# EAGLE design Callisto_Teknic_MSO_PBx4_single (EAGLE 9.6.2)
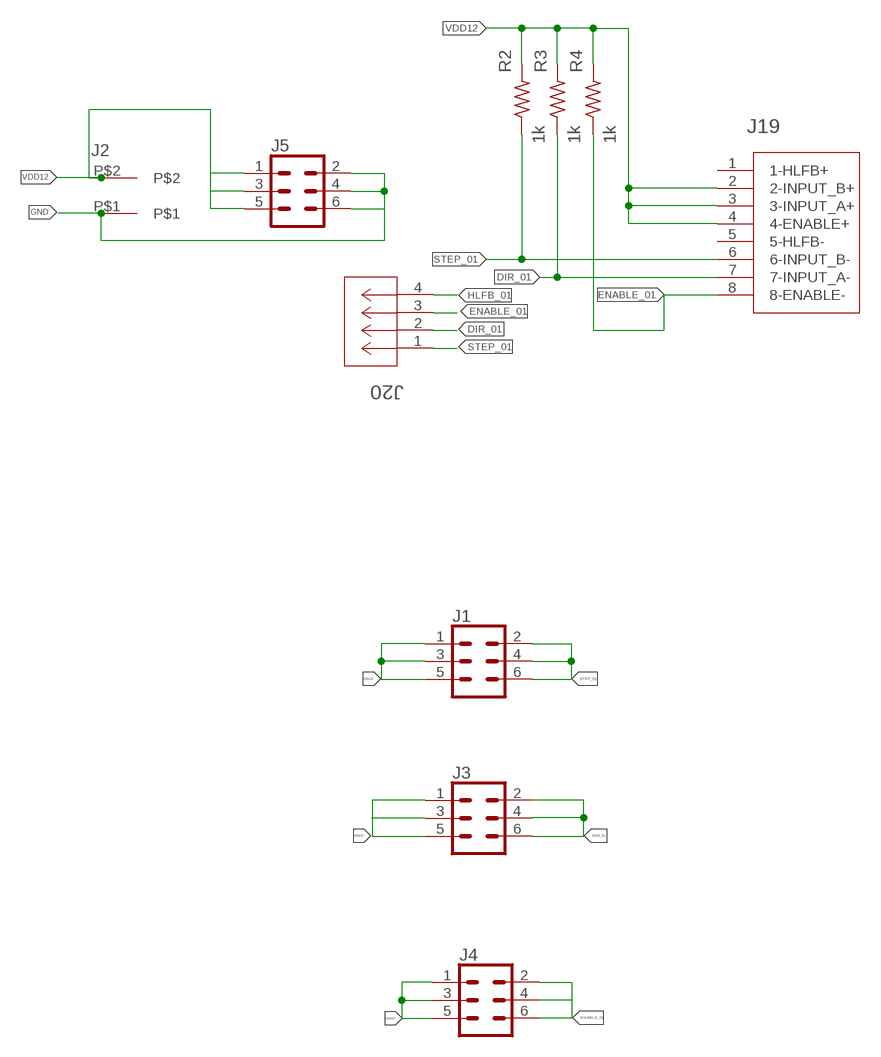
[diagram p0: schematic, sheet 1]

## Parts
J1  CONN_03X2  [2X3]
J2  2-pos  3.81MM_1_X_2_RT_ANGLE_PLUG_HEADER  [2_3.81MM_PITCH]
J3  CONN_03X2  [2X3]
J4  CONN_03X2  [2X3]
J5  CONN_03X2  [2X3]
J19  TEKNIC_8PIN_MOTOR  [CON_39281083]
J20  CONN_530470410_PICOBLADE_X_4  [CON_530470410_MOL]
R2  1k  R_0805  [0805]
R3  1k  R_0805  [0805]
R4  1k  R_0805  [0805]

## Nets
DIR_01: J3.2 J3.4 J3.6 J19.7(7-INPUT_A-) J20.2 R3.1
ENABLE_01: J4.2 J4.4 J4.6 J19.8(8-ENABLE-) J20.3 R4.1
GND: J1.1 J1.3 J1.5 J2.P$1 J3.1 J3.3 J3.5 J4.1 J4.3 J4.5 J5.2 J5.4 J5.6
HLFB_01: J20.4
STEP_01: J1.2 J1.4 J1.6 J19.6(6-INPUT_B-) J20.1 R2.1
VDD12: J2.P$2 J5.1 J5.3 J5.5 J19.2(2-INPUT_B+) J19.3(3-INPUT_A+) J19.4(4-ENABLE+) R2.2 R3.2 R4.2
Unconnected: J19.1(1-HLFB+) J19.5(5-HLFB-)

## Library data of the parts
J1 J3-J5 = 3D_MIG_Controller:CONN_03X2: Multi connection point. Often used as Generic Header-pin footprint for 0.1 inch spaced/style header connections For AVR SPI programming port, see special device with nice symbol: "AVR_SPI_PROG_5x2.dev" You can populate with any combo of single row headers, but if you'd like an exact match, check these: 2x5 AVR ICSP Male Header <https://www.sparkfun.com/products/778> (PRT-00778) 2x5 Pin Shrouded Header <https://www.sparkfun.com/products/8506> (PRT-08506) On any of the 0.1 inch spaced packages, you can populate with these: Break Away Headers - Straight <https://www.sparkfun.com/products/116> (PRT-00116) Break Away Male Headers - Right Angle <https://www.sparkfun.com/products/553> (PRT-00553) Female Headers <https://www.sparkfun.com/products/115> (PRT-00115) Break Away Headers - Machine Pin <https://www.sparkfun.com/products/117> (PRT-00117) Break Away Female Headers - Swiss Machine Pin <https://www.sparkfun.com/products/743> (PRT-00743) Special note: the shrouded connector mates well with our 5x2 ribbon cables: 2x5 Pin IDC Ribbon Cable <https://www.sparkfun.com/products/8535> (PRT-08535)
J2 = 3D_MIG_Controller:3.81MM_1_X_2_RT_ANGLE_PLUG_HEADER: TERM BLOCK HDR 2POS 90DEG 3.81MM; PARTNO: 691322310002
J19 = 3D_MIG_Controller:TEKNIC_8PIN_MOTOR; COPYRIGHT: Copyright (C) 2022 Ultra Librarian. All rights reserved.; MANUFACTURER_PART_NUMBER: 39281083; MFR_NAME: Molex Connector Corporation
J20 = 3D_MIG_Controller:CONN_530470410_PICOBLADE_X_4; COPYRIGHT: Copyright (C) 2022 Ultra Librarian. All rights reserved.; MANUFACTURER_PART_NUMBER: 530470410; MFR_NAME: Molex Connector Corporation
R2-R4 = 3D_MIG_Controller:R_0805

## Board
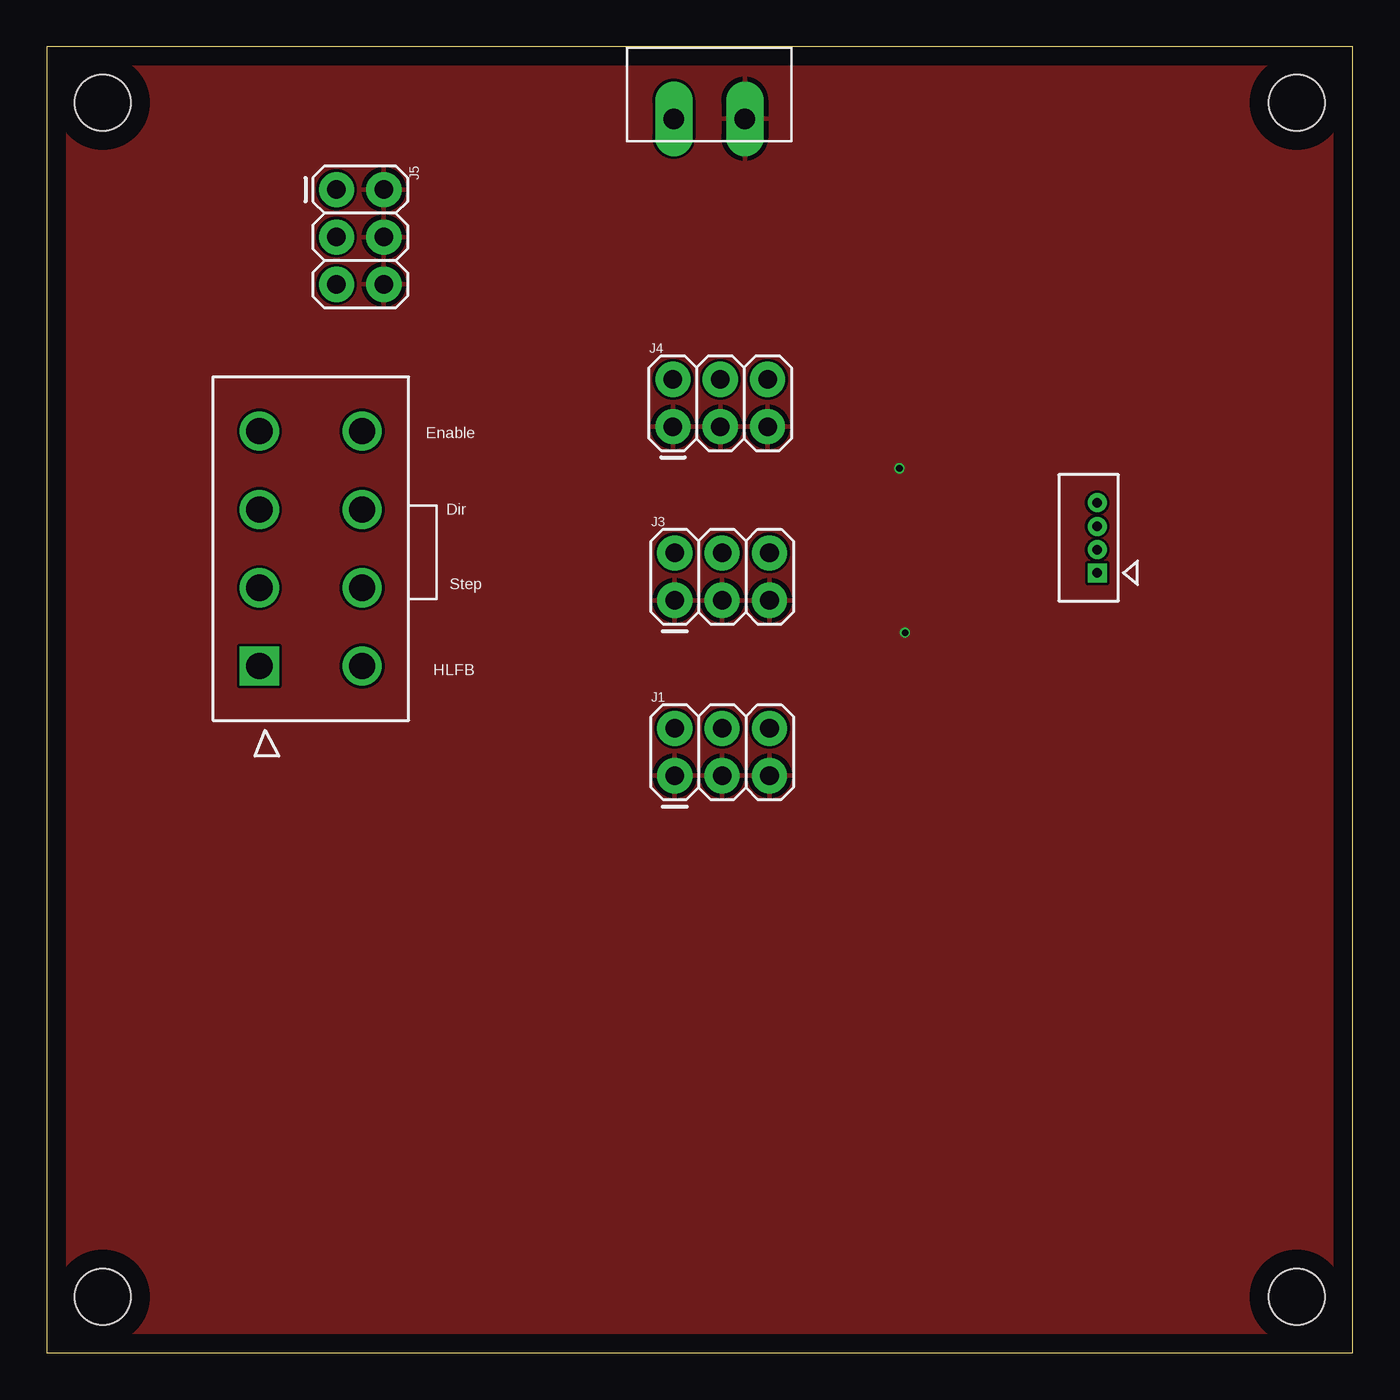
[diagram p1: board, top side]
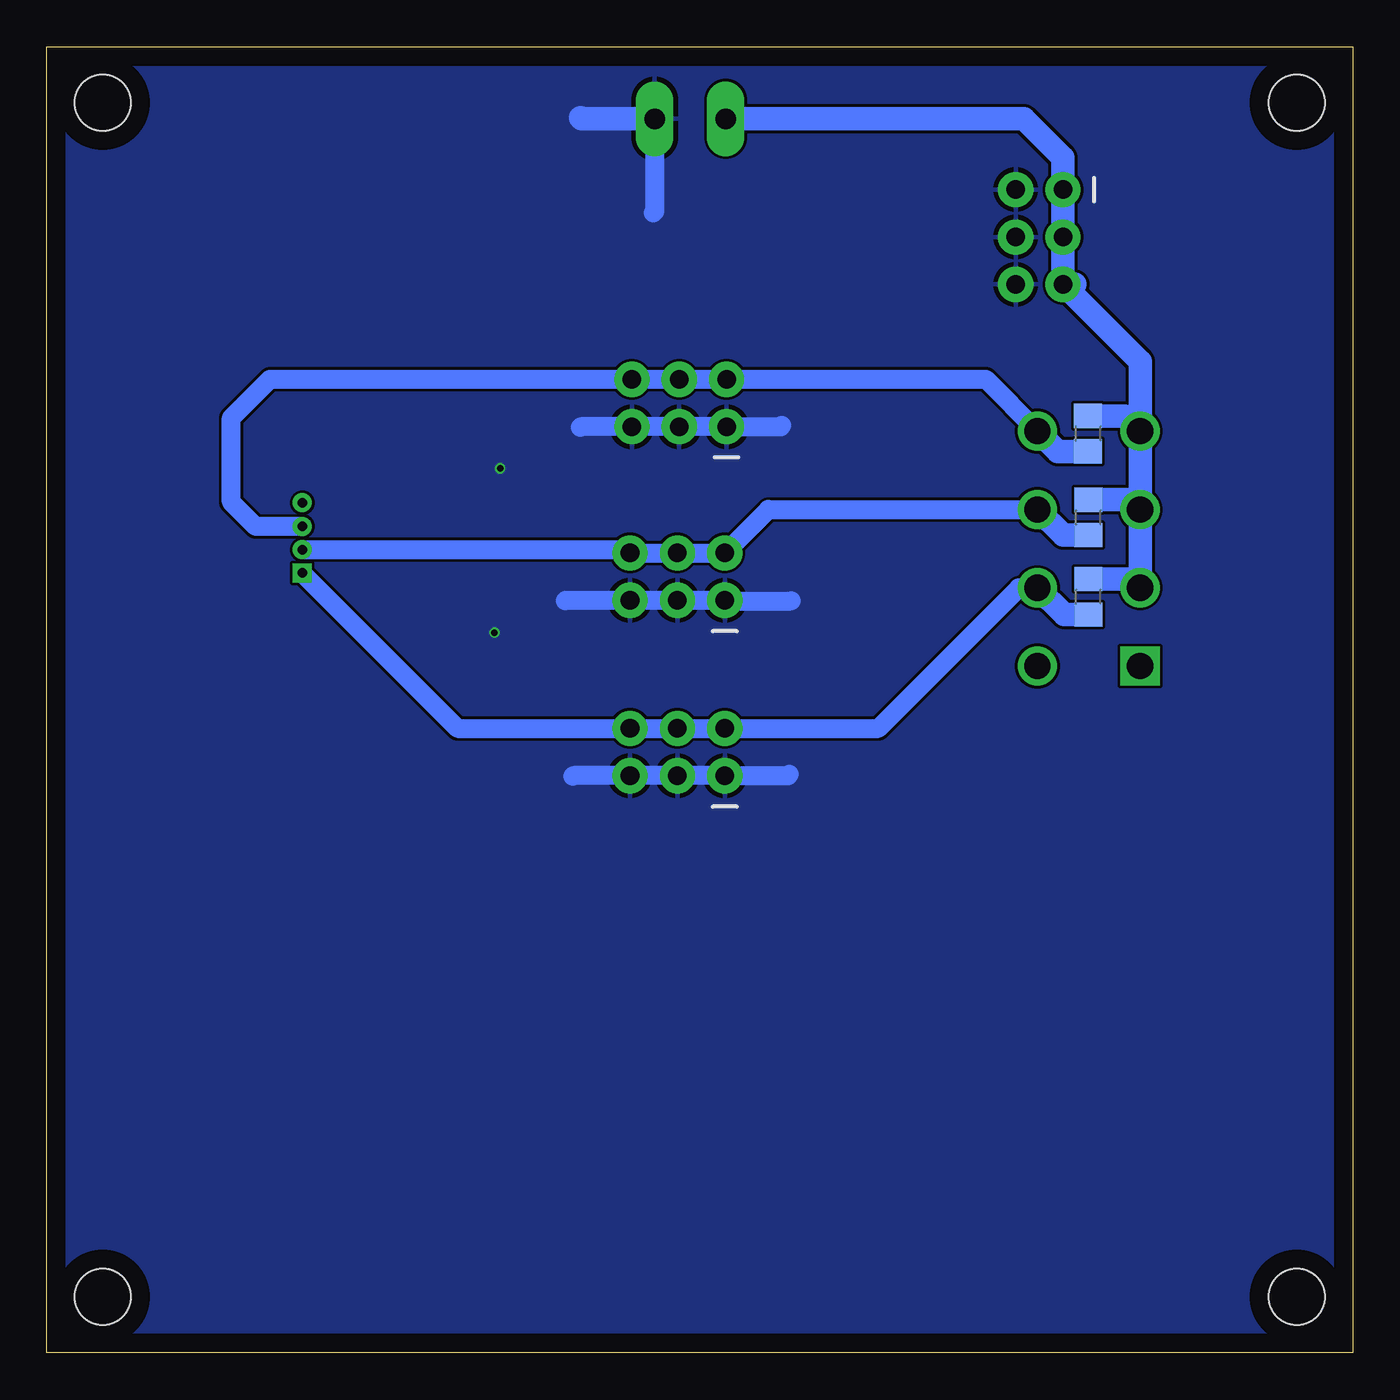
[diagram p2: board, bottom side, seen from below]

Size 70 x 70 mm. Coordinates in mm from the lower left corner, seen from the top.
Outline: 0,0 70,0 70,70 0,70 0,0
Copper layers (1*16): Top 0.035mm / dielectric 1.5mm / Bottom 0.035mm
Design rules "default": minimum track width 6mil, minimum drill 0.2mm, track to track 6mil, track to pad 6mil, pad to pad 6mil, via to via 6mil, smd to smd 6mil, copper to edge 40mil, drill to drill 6mil, minimum pad ring 10mil, minimum via ring 4mil, stop-mask expansion 4mil, vias tented up to drill 0mil, thermal gap 10mil
Holes 3 mm at 3,3 67,3 67,67 3,67

### Footprints (pad centres in the part's own frame; a part is rotated, then mirrored left to right if it is on the bottom)
2X3 = drill 1 pad 1.88: 1 -2.54,-1.27; 2 -2.54,1.27; 3 0,-1.27; 4 0,1.27; 5 2.54,-1.27; 6 2.54,1.27
2_3.81MM_PITCH = drill 1.1 pad 2 long: P$1 0,0; P$2 3.81,0
CON_39281083 = drill 1.397 pad 1.905 square: 1 12.6,-5.5 | drill 1.397 pad 1.905: 2 8.4,-5.5; 3 4.2,-5.5; 4 0,-5.5; 5 12.6,0; 6 8.4,0; 7 4.2,0; 8 0,0
CON_530470410_MOL = drill 0.508 pad 0.838 square: 1 0,0 | drill 0.508 pad 0.838: 2 -1.245,0; 3 -2.489,0; 4 -3.759,0
0805 = smd 1.3 x 1.5: 1 -0.95,0; 2 0.95,0

### Placement (x,y rotation side)
J1  36.2,32.2 0 top
J2  37.42,66.13 180 top
J3  36.2,41.6 0 top
J4  36.1,50.9 0 top
J5  16.8,59.8 270 top
J19  16.9,49.4 270 top
J20  56.3,41.8 270 top
R2  14.18,40.52 90 bottom
R3  14.18,44.77 90 bottom
R4  14.19,49.26 90 bottom

### Tracks (layer width: path | path; a pad name or v marks a point on that pad's centre or on a via)
DIR_01
  Bottom 1.016: J20.2 38.91,43.05 J3.6 J3.4 J3.2 31.33,45.2 J19.7
  Bottom 1.27: R3.1 15.52,43.82 J19.7
ENABLE_01
  Bottom 1.016: J20.3 58.79,44.29 60.1,45.6 60.1,50.1 58.03,52.17 J4.6 J4.4 J4.2 19.67,52.17 J19.8
  Bottom 1.27: R4.1 15.81,48.31 J19.8
GND  (via drill 0.35)
  Bottom 1.016: 42.2,40.3 42.17,40.33 J3.5 J3.3 J3.1 33.63,40.3 30.1,40.3 | 41.4,49.6 41.37,49.63 J4.5 J4.3 J4.1 30.67,49.63 30.6,49.7 | 41.8,30.9 41.77,30.93 J1.5 J1.3 J1.1 30.27,30.93 30.2,31 | J2.P$1 37.42,61.18 37.5,61.1
  Bottom 1.27: J2.P$1 41.33,66.13 41.4,66.2
  other vias: 45.7,47.4 46,38.6
  pour Bottom: 0,70 70,70 70,0 0,0
  pour Top: 0,70.1 70,70.1 70,0 0,0
STEP_01
  Bottom 1.016: J20.1 47.97,33.47 J1.6 J1.4 J1.2 25.43,33.47 17.9,41 J19.6
  Bottom 1.27: R2.1 15.47,39.57 J19.6
VDD12
  Bottom 1.27: J2.P$2 17.62,66.13 15.53,64.04 J5.1 J5.3 J5.5 | J5.5 14.9,57.26 | J5.5 11.4,53.13 J19.4 | J19.4 J19.3 | J19.3 J19.2 11.87,41.47 R2.2 | J19.4 12.21,50.21 R4.2 | J19.3 11.92,45.72 R3.2

### Text on the board
tPlace: Enable | Dir | Step | HLFB